# EAGLE design ESP32 AT UWB Pro with Display v1.1 (EAGLE 6.1)
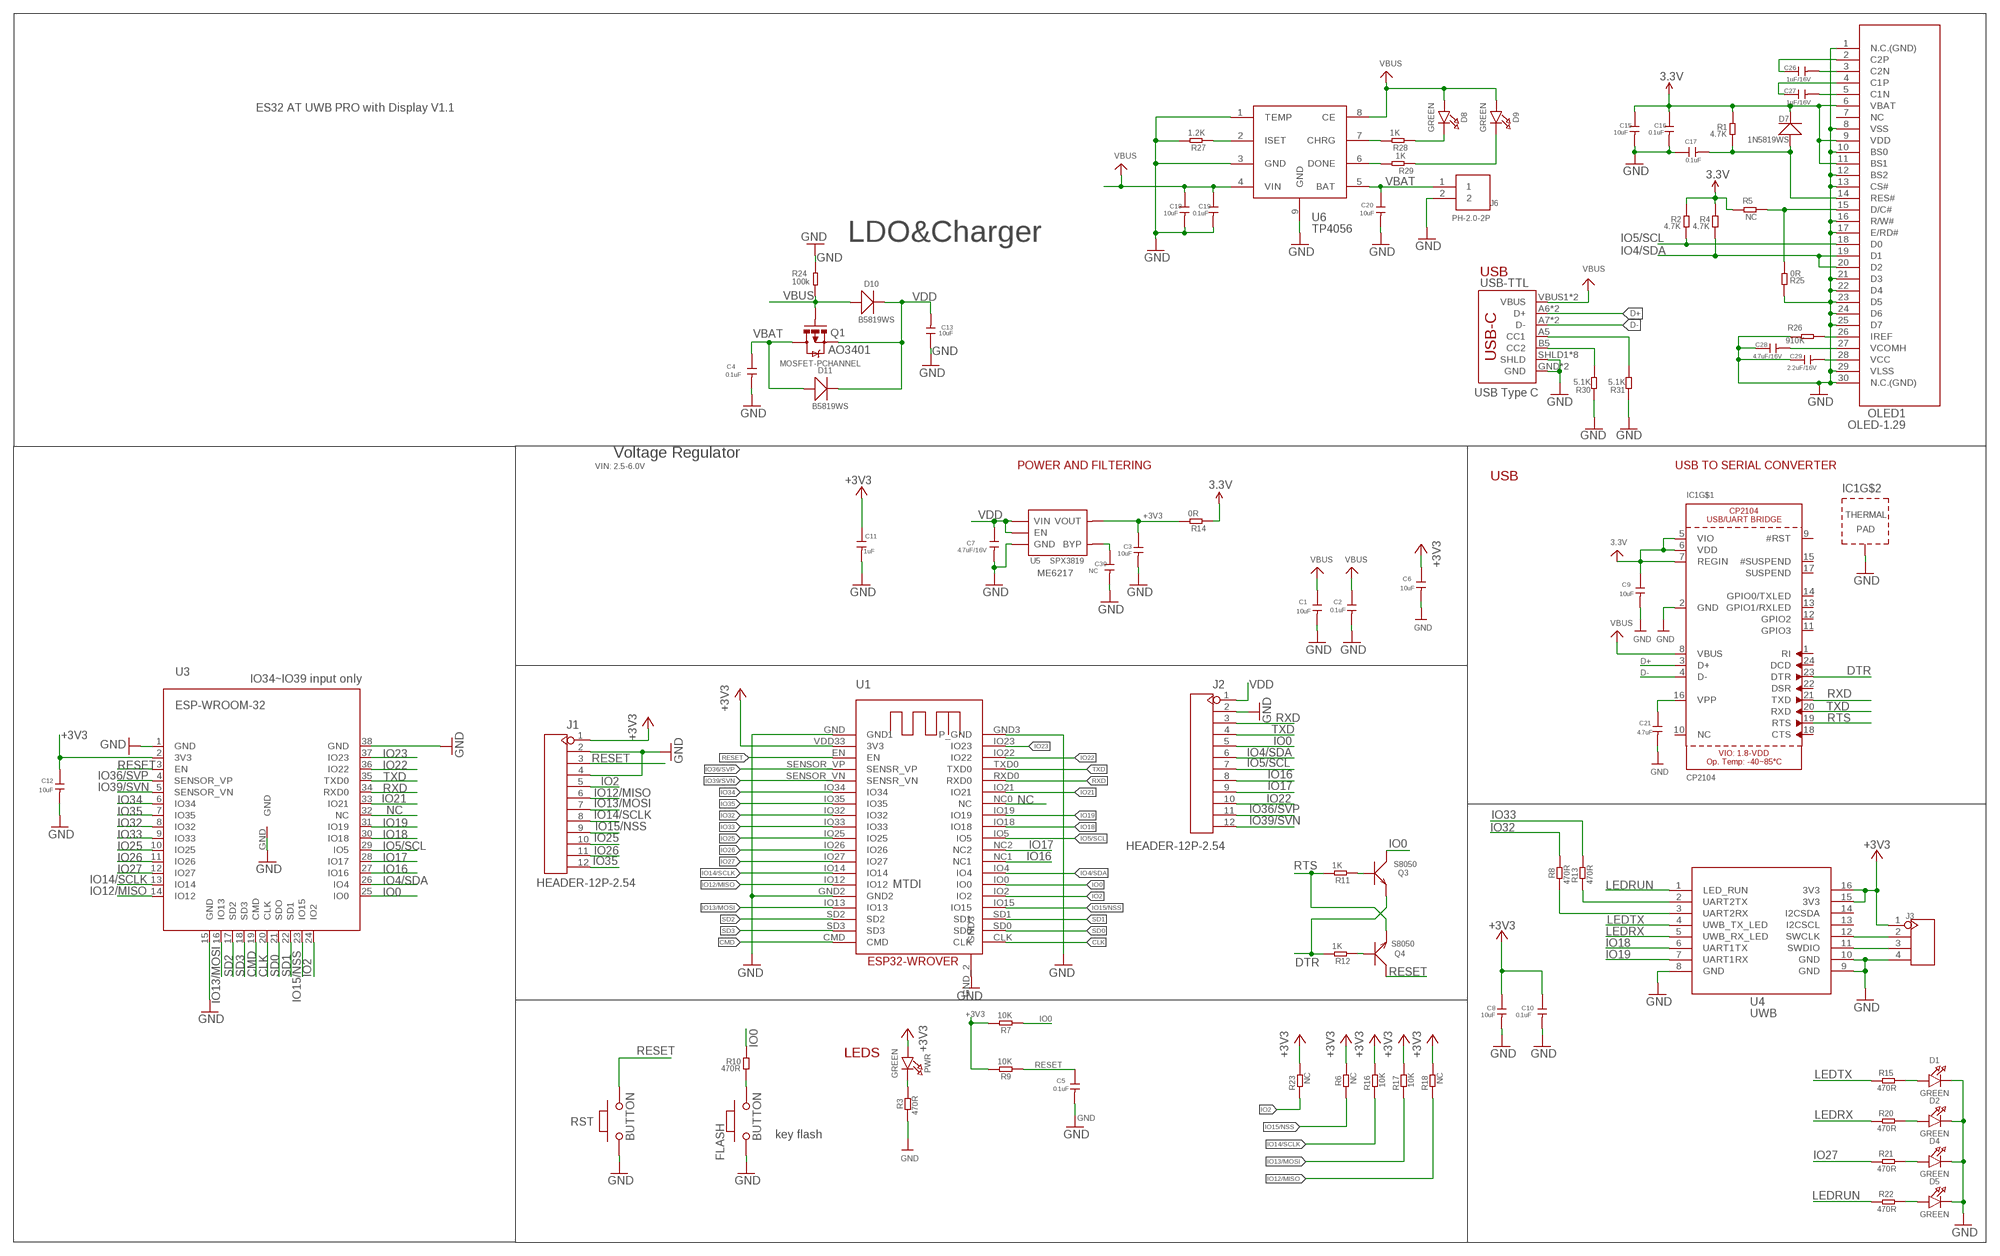
[diagram p0: schematic, sheet 1]

## Parts
C1  10uF  C-0603  [0603]
C2  0.1uF  C-0603  [0603]
C3  10uF  C-0603  [0603]
C4  0.1uF  C-0603  [0603]
C5  0.1uF  C-0603  [0603]
C6  10uF  C-0603  [0603]
C7  4.7uF/16V  C-0603  [0603]
C8  10uF  C-0603  [0603]
C9  10uF  C-0603  [0603]
C10  0.1uF  C-0603  [0603]
C11  1uF  C-0603  [0603]
C12  10uF  C-0603  [0603]
C13  10uF  C-0603  [0603]
C15  10uF  C-0603  [0603]
C16  0.1uF  C-0603  [0603]
C17  0.1uF  C-0603  [0603]
C18  10uF  C-0603  [0603]
C19  0.1uF  C-0603  [0603]
C20  10uF  C-0603  [0603]
C21  4.7uF  C-0603  [0603]
C26  1uF/16V  C-0603  [0603]
C27  1uF/16V  C-0603  [0603]
C28  4.7uF/16V  C-0603  [0603]
C29  2.2uF/16V  C-0603  [0603]
C30  NC  C-0603  [0603]
D1  GREEN  LED0805_NOOUTLINE  [CHIPLED_0805_NOOUTLINE]
D2  GREEN  LED0805_NOOUTLINE  [CHIPLED_0805_NOOUTLINE]
D4  GREEN  LED0805_NOOUTLINE  [CHIPLED_0805_NOOUTLINE]
D5  GREEN  LED0805_NOOUTLINE  [CHIPLED_0805_NOOUTLINE]
D7  1N5819WS  D'0805'  [SOD323]
D8  GREEN  LED0805_NOOUTLINE  [CHIPLED_0805_NOOUTLINE]
D9  GREEN  LED0805_NOOUTLINE  [CHIPLED_0805_NOOUTLINE]
D10  B5819WS  D'0805'  [SOD323]
D11  B5819WS  D'0805'  [SOD323]
FLASH  BUTTON  PB157  [157SW]
IC1  CP2104  [QFN24_4MM_SMSC]
J1  HEADER-12P-2.54  [12P-2.54]
J2  HEADER-12P-2.54  [12P-2.54]
J3  HEADER-4P-60/35MILROUND  [4P-65/35ROUND]
J6  PH-2.0-2P  [PH-2.0-2P]
OLED1  OLED-1.29  [OLED-1.29]
PWR  GREEN  LED0805_NOOUTLINE  [CHIPLED_0805_NOOUTLINE]
Q1  MOSFET-PCHANNEL  [SOT23-3]
Q3  S8050  TRANSISTOR-NPN-SOT23  [SOT23]
Q4  S8050  TRANSISTOR-NPN-SOT23  [SOT23]
R1  4.7K  R-0603  [R0603]
R2  4.7K  R-0603  [R0603]
R3  470R  R-0603  [R0603]
R4  4.7K  R-0603  [R0603]
R5  NC  R-0603  [R0603]
R6  NC  R-0603  [R0603]
R7  10K  R-0603  [R0603]
R8  470R  R-0603  [R0603]
R9  10K  R-0603  [R0603]
R10  470R  R-0603  [R0603]
R11  1K  R-0603  [R0603]
R12  1K  R-0603  [R0603]
R13  470R  R-0603  [R0603]
R14  0R  R-0603  [R0603]
R15  470R  R-0603  [R0603]
R16  10K  R-0603  [R0603]
R17  10K  R-0603  [R0603]
R18  NC  R-0603  [R0603]
R20  470R  R-0603  [R0603]
R21  470R  R-0603  [R0603]
R22  470R  R-0603  [R0603]
R23  NC  R-0603  [R0603]
R24  100k  R-0603  [R0603]
R25  0R  R-0603  [R0603]
R26  910K  R-0603  [R0603]
R27  1.2K  R-0603  [R0603]
R28  1K  R-0603  [R0603]
R29  1K  R-0603  [R0603]
R30  5.1K  DISCRETE_R-0603  [DISCRETE_R0603]
R31  5.1K  DISCRETE_R-0603  [DISCRETE_R0603]
RST  BUTTON  PB157  [157SW]
U1  ESP32-WROVER  [ESP32-WROVER]
U3  ESP-WROOM-32  [ESP-WROOM-32]
U4  UWB  [UWB]
U5  SPX3819  [SOT23-5]
U6  TP4056  [SOP8-1.27P]
USB-TTL  USB_C5  [USB-C-16P-5]

## Nets
3.3V: C15.1 C16.1 D7.- OLED1.6(VBAT) OLED1.9(VDD) OLED1.11(BS1) R1.2 R2.2 R4.2 R5.2 R14.1
+3V3: C3.1 C6.1 C8.1 C9.1 C10.1 C11.1 C12.1 IC1.5(VIO) IC1.6(VDD) IC1.7(REGIN) J1.1 J3.1 PWR.A R6.2 R7.2 R9.2 R14.2 R16.2 R17.2 R18.2 R23.2 U1.VDD33(3V3) U3.2(3V3) U4.15(3V3) U4.16(3V3) U5.5(VOUT) ; supply symbol labelled 3.3V
CLK: U1.CLK U3.20(CLK)
CMD: U1.CMD U3.19(CMD)
D+: IC1.3(D+) USB-TTL.A6(D+) USB-TTL.B6(D+)
D-: IC1.4(D-) USB-TTL.A7(D-) USB-TTL.B7(D-)
DTR: IC1.23(DTR) Q3.2(E) R12.2
GND: C1.2 C2.2 C3.2 C4.2 C5.2 C6.2 C7.2 C8.2 C9.2 C10.2 C11.2 C12.2 C13.1 C15.2 C16.2 C17.1 C18.2 C19.2 C20.2 C21.2 C28.1 C29.1 C30.2 D1.C D2.C D4.C D5.C FLASH.1 IC1.2(GND) IC1.THERM(TP) J1.2 J1.4 J2.2 J3.4 J6.2 OLED1.1(N.C.(GND)) OLED1.8(VSS) OLED1.10(BS0) OLED1.12(BS2) OLED1.13(CS#) OLED1.16(R/W#) OLED1.17(E/RD#) OLED1.21(D3) OLED1.22(D4) OLED1.23(D5) OLED1.24(D6) OLED1.25(D7) OLED1.29(VLSS) OLED1.30(N.C.(GND)) R3.1 R24.2 R25.2 R26.2 R27.2 R30.1 R31.1 RST.1 U1.GND2 U1.GND3(P_GND) U1.GND(GND1) U1.GND_2(GND3) U3.1(GND) U3.15(GND) U3.38(GND) U3.GND U4.8(GND) U4.9(GND) U4.10(GND) U5.2(GND) U6.1(TEMP) U6.3(GND) U6.9(GND) USB-TTL.GND USB-TTL.GND2(GND) USB-TTL.SHLD1(SHLD) USB-TTL.SHLD2(SHLD) USB-TTL.SHLD3(SHLD) USB-TTL.SHLD4(SHLD) USB-TTL.SHLD5(SHLD) USB-TTL.SHLD6(SHLD) USB-TTL.SHLD7(SHLD) USB-TTL.SHLD8(SHLD)
IO0: J2.5 Q3.3(C) R7.1 R10.2 U1.IO0 U3.25(IO0)
IO2: J1.5 R23.1 U1.IO2 U3.24(IO2)
IO4/SDA: J2.6 OLED1.19(D1) OLED1.20(D2) R4.1 U1.IO4 U3.26(IO4)
IO5/SCL: J2.7 OLED1.18(D0) R2.1 U1.IO5 U3.29(IO5)
IO12/MISO: J1.6 R18.1 U1.IO12 U3.14(IO12)
IO13/MOSI: J1.7 R17.1 U1.IO13 U3.16(IO13)
IO14/SCLK: J1.8 R16.1 U1.IO14 U3.13(IO14)
IO15/NSS: J1.9 R6.1 U1.IO15 U3.23(IO15)
IO16: J2.8 U1.NC1 U3.27(IO16)
IO17: J2.9 U1.NC2 U3.28(IO17)
IO18: U1.IO18 U3.30(IO18) U4.6(UART1TX)
IO19: U1.IO19 U3.31(IO19) U4.7(UART1RX)
IO21: U1.IO21 U3.33(IO21)
IO22: J2.10 U1.IO22 U3.36(IO22)
IO23: U1.IO23 U3.37(IO23)
IO25: J1.10 U1.IO25 U3.10(IO25)
IO26: J1.11 U1.IO26 U3.11(IO26)
IO27: R21.1 U1.IO27 U3.12(IO27)
IO32: R8.2 U1.IO32 U3.8(IO32)
IO33: R13.2 U1.IO33 U3.9(IO33)
IO34: U1.IO34 U3.6(IO34)
IO35: J1.12 U1.IO35 U3.7(IO35)
IO36/SVP: J2.11 U1.SENSOR_VP(SENSR_VP) U3.4(SENSOR_VP)
IO39/SVN: J2.12 U1.SENSOR_VN(SENSR_VN) U3.5(SENSOR_VN)
LEDRUN: R22.1 U4.1(LED_RUN)
LEDRX: R20.1 U4.5(UWB_RX_LED)
LEDTX: R15.1 U4.4(UWB_TX_LED)
N$1: D1.A R15.2
N$2: C21.1 IC1.16(VPP)
N$3: C17.2 D7.+ OLED1.14(RES#) R1.1
N$4: OLED1.15(D/C#) R5.1 R25.1
N$5: PWR.C R3.2
N$6: C28.2 OLED1.27(VCOMH)
N$7: C26.2 OLED1.3(C2N)
N$8: C29.2 OLED1.28(VCC)
N$9: OLED1.26(IREF) R26.1
N$10: R13.1 U4.2(UART2TX)
N$11: R8.1 U4.3(UART2RX)
N$13: Q4.1(B) R12.1
N$14: Q3.1(B) R11.1
N$15: FLASH.2 R10.1
N$16: D2.A R20.2
N$17: D4.A R21.2
N$18: D5.A R22.2
N$19: C26.1 OLED1.2(C2P)
N$21: C27.1 OLED1.4(C1P)
N$22: C27.2 OLED1.5(C1N)
N$23: R27.1 U6.2(ISET)
N$25: R31.2 USB-TTL.A5(CC1)
N$26: R30.2 USB-TTL.B5(CC2)
N$27: J3.3 U4.11(SWDIO)
N$28: J3.2 U4.12(SWCLK)
N$29: R28.2 U6.7(CHRG)
N$30: R29.2 U6.6(DONE)
N$31: D8.C R28.1
N$32: D9.C R29.1
N$76: C30.1 U5.4(BYP)
NC: U1.NC0(NC) U3.32(NC)
RESET: C5.1 J1.3 Q4.3(C) R9.1 RST.2 U1.EN U3.3(EN)
RTS: IC1.19(RTS) Q4.2(E) R11.2
RXD: IC1.21(TXD) J2.3 U1.RXD0 U3.34(RXD0)
SD0: U1.SD0 U3.21(SDO)
SD1: U1.SD1 U3.22(SD1)
SD2: U1.SD2 U3.17(SD2)
SD3: U1.SD3 U3.18(SD3)
TXD: IC1.20(RXD) J2.4 U1.TXD0 U3.35(TXD0)
VBAT: C4.1 C20.1 D11.+ J6.1 Q1.3(D) U6.5(BAT)
VBUS: C1.1 C2.1 C18.1 C19.1 D8.A D9.A D10.+ IC1.8(VBUS) Q1.1(G) R24.1 U6.4(VIN) U6.8(CE) USB-TTL.VBUS1(VBUS) USB-TTL.VBUS2(VBUS)
VDD: C7.1 C13.2 D10.- D11.- J2.1 Q1.2(S) U5.1(VIN) U5.3(EN)
Unconnected: IC1.1(RI) IC1.9(#RST) IC1.10(NC) IC1.11(GPIO3) IC1.12(GPIO2) IC1.13(GPIO1/RXLED) IC1.14(GPIO0/TXLED) IC1.15(#SUSPEND) IC1.17(SUSPEND) IC1.18(CTS) IC1.22(DSR) IC1.24(DCD) OLED1.7(NC) U4.13(I2CSCL) U4.14(I2CSDA)

## Notes on the sheet
- ES32 AT UWB PRO with Display V1.1
- LDO&Charger
- USB
- AO3401
- USB Type C
- Voltage Regulator
- VIN: 2.5-6.0V | POWER AND FILTERING | USB TO SERIAL CONVERTER
- USB
- ME6217
- IO34~IO39 input only
- MTDI
- LEDS
- key flash

## Library data of the parts
C1-C13 C15-C21 C26-C30 = Discrete:C*: Ceramic Capacitors
D1 D2 D4 D5 D8 D9 PWR = microbuilder:LED: LED 0603 - 0603 Surface Mount Package 2mA: Green LED - Low Power (3.9mcd, 2ma, 1.7Vf) - Digikey: 475-2709-2-ND Orange LED - Low Power (9.8mcd, 2ma, 1.8Vf) - Digikey: 475-1194-2-ND Red LED - Low Power (5mcd, 2ma, 1.8Vf) - Digikey: 475-1195-2-ND Yellow LED - Low Power (7mcd, 2ma, 1.8Vf) - Digikey: 475-1196-2-ND 5mA: Blue LED - Low Power (17mcd, 5ma, 2.9Vf) - Digikey: LNJ937W8CRACT-ND 0805 - 0805 Surface Mount Package 2mA: Red LED (8.8mcd, 2mA, 1.8Vf, Clear) - Low Power [Digikey: 475-2510-1-ND] Green LED (5mcd, 2mA, 1.8Vf, Clear) - Low Power [Digikey: 475-2730-1-ND] Yellow LED (11.3mcd, 2mA, 1.8Vf, Clear) - Low Power [Digikey: 475-2555-1-ND] 20mA: Red LED (104mcd, 20mA, Diffused) - LS R976 [Digikey: 475-1278-6-ND] Red LED (12mcd, 20mA, 2.0Vf, Clear) - APT2012EC [Digikey: 754-1128-1-ND] Green LED (15mcd, 20mA, 2.2Vf, Clear) - APT2012GC [Digikey: 754-1131-1-ND] Orange LED (160mcd, 20mA, 2.1Vf, Clear) - APT2012SECK [Digikey: 754-1130-1-ND] 1206 - 1206 Surface Mount Package Green LED (26mcd, 20mA, Diffused) - LG N971 [Digikey: 475-1407-6-ND] Red LED (15mcd, 20mA, Diffused) - LH N974 [Digikey: 475-1416-6-ND] Cree - Cree High-Power Surface Mount LEDs XPEBWT-L1-0000-00D50 - White 111lm 350mA 2.9Vf 6200K 110° XTEAWT-00-0000-00000LEE3 - White 114lm 350mA 2.85Vf 5000K 115° Everlight - Everlight 45-21 Series Surface Mount LEDs 45-21/QK2C-B2832AC2CB2/2T - Warm White 2000mcd 20mA 3.25Vf 3050K 120° 45-21/LK2C-B38452C4CB2/2T - Nuetral White 2000mcd 20mA 3.25Vf 4150K 120° 45-21/LK2C-B50634C6CB2/2T - Cold White 2200mcd 20mA 3.25Vf 5650K 120° PLCC2 Reverse Mount LS T77K-J1L2-1-0-2-R18-Z - Red 11.25mcd 2mA 1.8Vf 630nm 120° LO T77K-L1M2-24-Z - Orange 19.6mcd 2mA 1.8Vf 606nm 120° LY T77K-K2M1-26-Z - Yellow 15.7mcd 2mA 1.8Vf 587nm 120°
D7 D10 D11 = Discrete:D*
FLASH RST = MySMD:PB157
IC1 = microbuilder:CP2104: CP2104 - USB to UART Bridge VDD Output: 3.45V
J1 J2 = Connector:HEADER-12P
J3 = Connector:HEADER-4P
J6 = Connector:PH-2.0-2P
OLED1 = sale:OLED-1.29
Q1 = User-Submitted:MOSFET-PCHANNEL: Generic PMOSFET IRLML2244 - TRANS-11153 (SOT-23 -20V -4.3A) (1.Gate 2.Source 3.Drain) FQP27P06 - COM-10349 <http://www.sparkfun.com/products/10349> (TO-220 -60V -27A) (1.Gate 2.Source 3.Drain); PROD_ID: TRANS-08285
Q3 Q4 = Discrete:TRANSISTOR-NPN*: NPN audion
R1-R18 R20-R29 = Discrete:R*
R30 R31 = A9G:DISCRETE_R*
U1 = ESP32-Wrover:ESP32-WROVER
U3 = esp32:ESP-WROOM-32
U4 = sale:UWB
U5 = IC:SPX3819
U6 = self:TP4056
USB-TTL = USBC:USB_C: USB Type C 16Pin Connector Super Speed pins not available on the 16-pin purely SMD connector so this part is best for USB 2.0 implementations. D1 and D2 are tied together enabling D+/- no matter which way the cable is plugged into the connector. The two channel configuration pins (CC1/2) are exposed. These are normally connected to ground via 5.1k resistors but can be reconfigured for high current/high power applications.

## Net classes
0 default: width 0.152 mm, drill 0.305 mm, clearance 0.152 mm

## Board
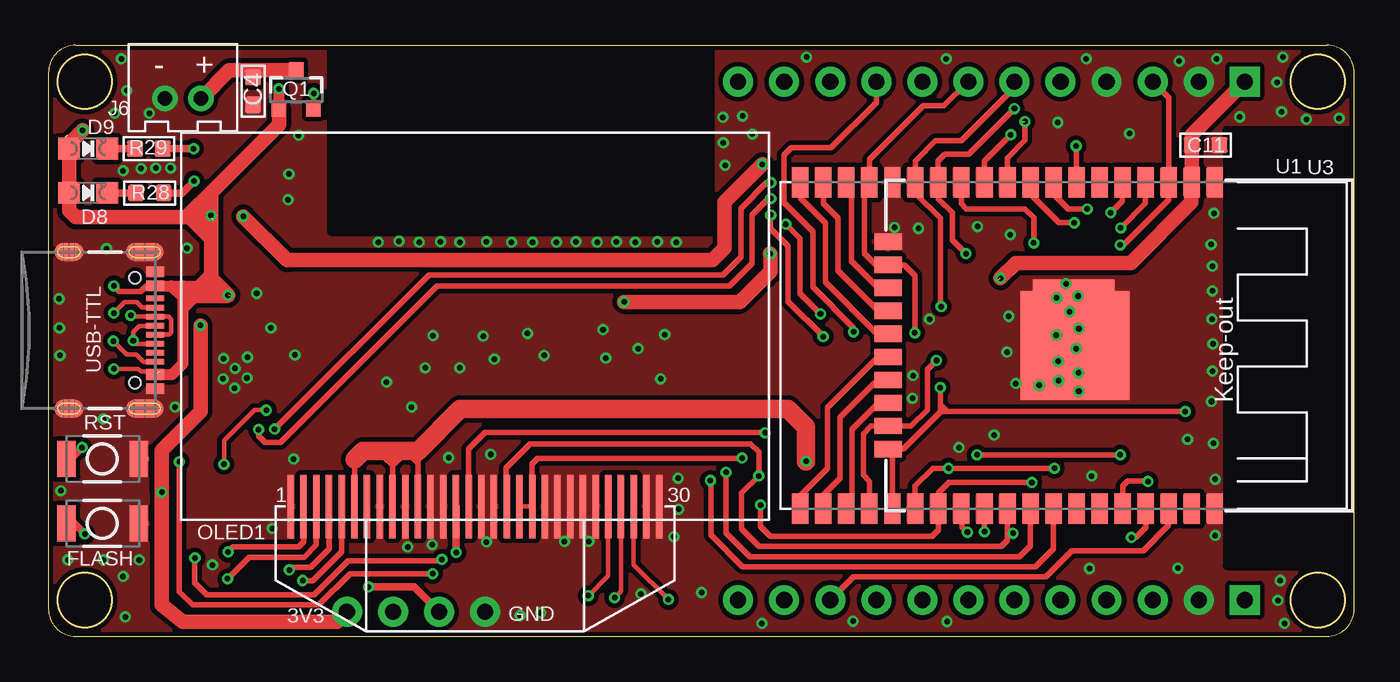
[diagram p1: board, top side]
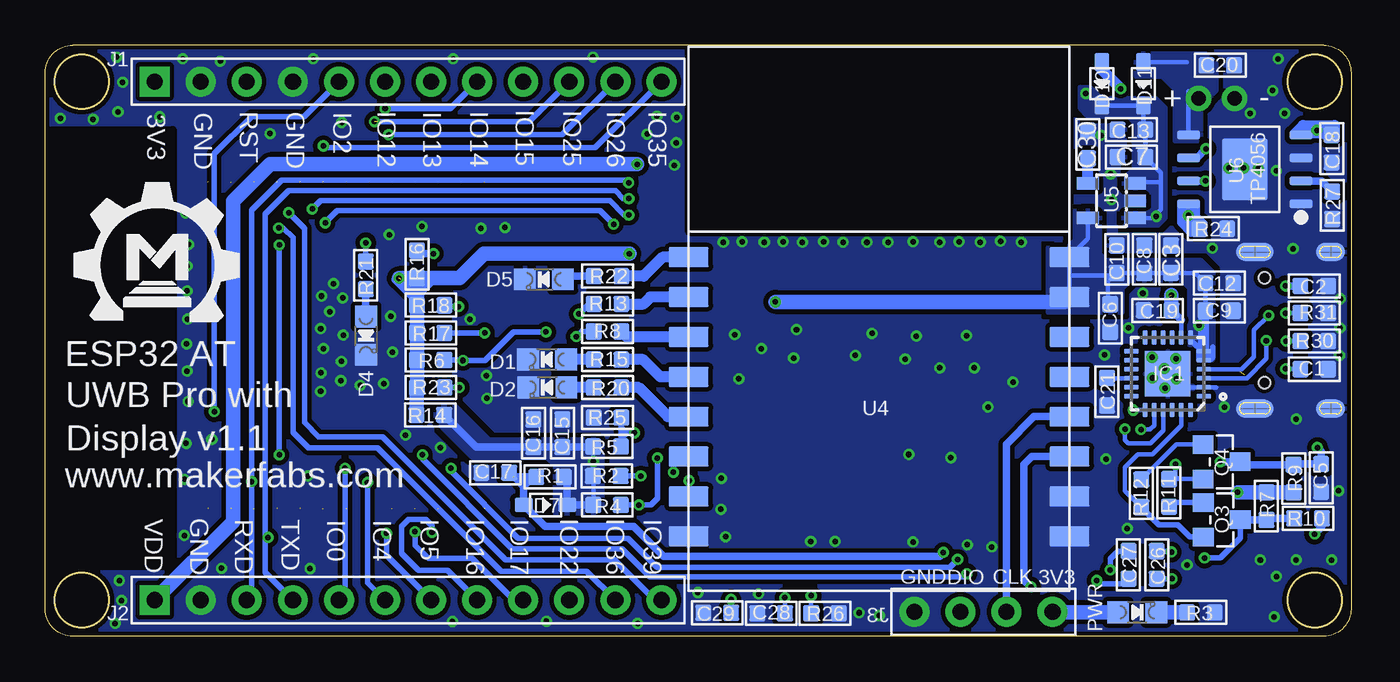
[diagram p2: board, bottom side, seen from below]

Size 72 x 32.6 mm. Coordinates in mm from the lower left corner, seen from the top.
Outline: 70.5,0 arc90 72,1.5 72,31.1 arc90 70.5,32.6 1.5,32.6 arc90 0,31.1 0,1.5 arc90 1.5,0 70.5,0
Outline: circle at 2,2 radius 1.5
Outline: circle at 2,30.6 radius 1.5
Outline: circle at 70,30.6 radius 1.5
Outline: circle at 70,2 radius 1.5
Copper layers (1*16): Top 0.035mm / dielectric 1.5mm / Bottom 0.035mm
Design rules: minimum track width 10mil, minimum drill 10mil, track to track 8mil, track to pad 8mil, pad to pad 8mil, via to via 8mil, smd to smd 0mil, copper to edge 10mil, drill to drill 8mil, minimum pad ring 10mil, minimum via ring 6mil, stop-mask expansion 4mil, vias tented up to drill 100mil, thermal gap 0mil
tRestrict: area 65,3.9 to 72,27.9; area 15.6,22.3 to 36.5,34.4
bRestrict: area 65,3.9 to 72,27.9; area 15.6,22.3 to 36.5,34.4

### Footprints (pad centres in the part's own frame; a part is rotated, then mirrored left to right if it is on the bottom)
0603 = smd 0.889 x 0.889: 1 -0.762,0; 2 0.762,0
CHIPLED_0805_NOOUTLINE = smd 1.2 x 1.2: A 0,-1.05; C 0,1.05
SOD323 = smd 1 x 0.8: + -1.2,0; - 1.2,0
157SW = smd 1.016 x 1.981: 1 0,0; 2 4,0
QFN24_4MM_SMSC = smd 0.8 x 0.28: 1 -2,1.25; 2 -2,0.75; 3 -2,0.25; 4 -2,-0.25; 5 -2,-0.75; 6 -2,-1.25; 13 2,-1.25; 14 2,-0.75; 15 2,-0.25; 16 2,0.25; 17 2,0.75; 18 2,1.25 | smd 0.28 x 0.8: 7 -1.25,-2; 8 -0.75,-2; 9 -0.25,-2; 10 0.25,-2; 11 0.75,-2; 12 1.25,-2; 19 1.25,2; 20 0.75,2; 21 0.25,2; 22 -0.25,2; 23 -0.75,2; 24 -1.25,2 | smd 2.5 x 2.5: THERM 0,0
12P-2.54 = drill 0.889 pad 1.651 square: 1 0,13.97 | drill 0.889 pad 1.651: 2 0,11.43; 3 0,8.89; 4 0,6.35; 5 0,3.81; 6 0,1.27; 7 0,-1.27; 8 0,-3.81; 9 0,-6.35; 10 0,-8.89; 11 0,-11.43; 12 0,-13.97
4P-65/35ROUND = drill 0.889 pad 1.651: 1 0,3.81; 2 0,1.27; 3 0,-1.27; 4 0,-3.81
PH-2.0-2P = drill 0.8 pad 1.4: 1 -1,0; 2 1,0
OLED-1.29 = smd 0.4 x 3.5: 1 -10.15,-9.94; 2 -9.45,-9.94; 3 -8.75,-9.94; 4 -8.05,-9.94; 5 -7.35,-9.94; 6 -6.65,-9.94; 7 -5.95,-9.94; 8 -5.25,-9.94; 9 -4.55,-9.94; 10 -3.85,-9.94; 11 -3.15,-9.94; 12 -2.45,-9.94; 13 -1.75,-9.94; 14 -1.05,-9.94; 15 -0.35,-9.94; 16 0.35,-9.94; 17 1.05,-9.94; 18 1.75,-9.94; 19 2.45,-9.94; 20 3.15,-9.94; 21 3.85,-9.94; 22 4.55,-9.94; 23 5.25,-9.94; 24 5.95,-9.94; 25 6.65,-9.94; 26 7.35,-9.94; 27 8.05,-9.94; 28 8.75,-9.94; 29 9.45,-9.94; 30 10.15,-9.94
SOT23-3 = smd 0.8 x 0.9: 1 -0.95,-1; 2 0.95,-1; 3 0,1.1
SOT23 = smd 1.016 x 1.143: 1 -0.95,-1.016; 2 0.95,-1.016; 3 0,1.016
R0603 = smd 0.889 x 0.889: 1 -0.762,0; 2 0.762,0
DISCRETE_R0603 = smd 0.889 x 0.889: 1 -0.762,0; 2 0.762,0
ESP32-WROVER = smd 1.7 x 0.9: CLK 18,1.27; CMD 0,1.27; EN 0,21.59; GND 0,24.13; GND3 18,24.13; GND_2 0,6.35; IO0 18,7.62; IO2 18,6.35; IO4 18,8.89; IO5 18,12.7; IO12 0,7.62; IO13 0,5.08; IO14 0,8.89; IO15 18,5.08; IO18 18,13.97; IO19 18,15.24; IO21 18,17.78; IO22 18,21.59; IO23 18,22.86; IO25 0,12.7; IO26 0,11.43; IO27 0,10.16; IO32 0,15.24; IO33 0,13.97; IO34 0,17.78; IO35 0,16.51; NC0 18,16.51; NC1 18,10.16; NC2 18,11.43; RXD0 18,19.05; SD0 18,2.54; SD1 18,3.81; SD2 0,3.81; SD3 0,2.54; SENSOR_VN 0,19.05; SENSOR_VP 0,20.32; TXD0 18,20.32; VDD33 0,22.86 | smd 4.5 x 4.5: GND2 7.62,16.34
ESP-WROOM-32 = smd 0.9 x 1.5: 1 7.7,9; 2 6.43,9; 3 5.16,9; 4 3.89,9; 5 2.62,9; 6 1.35,9; 7 0.08,9; 8 -1.19,9; 9 -2.46,9; 10 -3.73,9; 11 -5,9; 12 -6.27,9; 13 -7.54,9; 14 -8.81,9; 25 -8.81,-9; 26 -7.54,-9; 27 -6.27,-9; 28 -5,-9; 29 -3.73,-9; 30 -2.46,-9; 31 -1.19,-9; 32 0.08,-9; 33 1.35,-9; 34 2.62,-9; 35 3.89,-9; 36 5.16,-9; 37 6.43,-9; 38 7.7,-9 | smd 1.5 x 0.9: 15 -10.3,5.715; 16 -10.3,4.445; 17 -10.3,3.175; 18 -10.3,1.905; 19 -10.3,0.635; 20 -10.3,-0.635; 21 -10.3,-1.905; 22 -10.3,-3.175; 23 -10.3,-4.445; 24 -10.3,-5.715 | smd 6 x 6: GND 0,0
UWB = smd 2.2 x 1.1: 1 0,18.4; 2 0,16.2; 3 0,14; 4 0,11.8; 5 0,9.6; 6 0,7.4; 7 0,5.2; 8 0,3; 9 21,3; 10 21,5.2; 11 21,7.4; 12 21,9.6; 13 21,11.8; 14 21,14; 15 21,16.2; 16 21,18.4
SOT23-5 = smd 0.69 x 1.2: 1 -0.95,-1.3; 2 0,-1.3; 3 0.95,-1.3; 4 0.95,1.3; 5 -0.95,1.3
SOP8-1.27P = smd 1.27 x 0.51: 1 -3.1,1.905; 2 -3.1,0.635; 3 -3.1,-0.635; 4 -3.1,-1.905; 5 3.1,-1.905; 6 3.1,-0.635; 7 3.1,0.635; 8 3.1,1.905 | smd 2.5 x 3.4: 9 0,0
USB-C-16P-5 = smd 0.3 x 1: A5 -1.25,-0.34; A6 -0.25,-0.34; A7 0.25,-0.34; A8 1.25,-0.34; B5 1.75,-0.34; B6 0.75,-0.34; B7 -0.75,-0.34; B8 -1.75,-0.34 | smd 0.6 x 1: GND -3.225,-0.34; GND2 3.225,-0.34; VBUS1 -2.45,-0.34; VBUS2 2.45,-0.34 | smd 1 x 2.1: SHLD1 -4.32,-0.915; SHLD2 4.32,-0.915 | smd 1 x 2.1 bottom: SHLD3 -4.32,-0.915; SHLD4 4.32,-0.915 | smd 1 x 1.6: SHLD5 -4.32,-5.095; SHLD8 4.32,-5.095 | smd 1 x 1.6 bottom: SHLD6 -4.32,-5.095; SHLD7 4.32,-5.095 | hole 0.65: -2.89,-1.445; 2.89,-1.445

### Placement (x,y rotation side)
C1  2.03,14.73 0 bottom
C2  2.03,19.33 0 bottom
C3  9.93,20.8 90 bottom
C4  11.28,30.07 270 top
C5  1.65,8.74 270 bottom
C6  13.28,17.55 270 bottom
C7  12.12,26.44 180 bottom
C8  11.4,20.79 90 bottom
C9  7.26,17.96 0 bottom
C10  12.92,20.8 90 bottom
C11  63.8,27.1 0 top
C12  7.26,19.48 0 bottom
C13  12.12,27.94 0 bottom
C15  43.48,11.2 90 bottom
C16  45.09,11.2 90 bottom
C17  47.19,9.02 0 bottom
C18  1.07,26.9 270 bottom
C19  10.67,17.98 180 bottom
C20  7.21,31.5 0 bottom
C21  13.46,13.49 270 bottom
C26  10.72,3.94 270 bottom
C27  12.27,3.94 270 bottom
C28  31.98,1.27 0 bottom
C29  34.95,1.3 0 bottom
C30  14.5,27.13 90 bottom
D1  44.34,15.27 90 bottom
D2  44.32,13.73 90 bottom
D4  54.32,16.58 180 bottom
D5  44.51,19.69 90 bottom
D7  44.42,7.24 0 bottom
D8  2.18,24.46 270 top
D9  2.18,26.9 270 top
D10  13.74,30.48 270 bottom
D11  11.46,30.48 270 bottom
FLASH  5,6.22 180 top
IC1  10.11,14.48 180 bottom
J1  52,30.6 90 bottom
J2  52,2 90 bottom
J3  20.27,1.35 270 bottom
J6  7.42,29.67 180 top
OLED1  23.52,17.09 0 top
PWR  11.79,1.33 270 bottom
Q1  13.67,30.12 0 top
Q3  7.13,6.42 270 bottom
Q4  7.14,9.63 270 bottom
R1  44.17,8.79 0 bottom
R2  41.05,8.84 180 bottom
R3  8.28,1.32 180 bottom
R4  41.02,7.24 180 bottom
R5  41.02,10.46 180 bottom
R6  50.75,15.24 180 bottom
R7  4.67,7.18 90 bottom
R8  41,16.81 180 bottom
R9  3.17,8.7 270 bottom
R10  2.37,6.51 180 bottom
R11  10.04,7.91 90 bottom
R12  11.57,7.89 270 bottom
R13  41,18.34 180 bottom
R14  50.77,12.22 180 bottom
R15  41,15.27 180 bottom
R16  51.51,20.52 270 bottom
R17  50.75,16.74 180 bottom
R18  50.75,18.26 180 bottom
R20  41,13.72 180 bottom
R21  54.33,19.91 270 bottom
R22  41,19.86 180 bottom
R23  50.75,13.72 180 bottom
R24  7.59,22.48 0 bottom
R25  41,12.06 180 bottom
R26  29.01,1.27 0 bottom
R27  1.04,23.77 270 bottom
R28  5.59,24.46 0 top
R29  5.54,26.9 0 top
R30  2.03,16.28 180 bottom
R31  2.03,17.83 180 bottom
RST  5,9.78 180 top
U1  40.19,25.04 270 top
U3  56.6,16.05 0 top
U4  36.53,2.51 0 bottom
U5  13.21,24.03 90 bottom
U6  5.87,25.76 180 bottom
U$1  [MAKERFABS_0.3]  69.94,17.41 0 bottom
USB-TTL  6.22,16.88 270 top

### Tracks (layer width: path | path; a pad name or v marks a point on that pad's centre or on a via)
3.3V  (via drill 0.3)
  Top 0.305: OLED1.11 20.37,10.01 | 20.37,10.11 20.37,10.21 | OLED1.6 16.87,9.76 | 20.24,10.24 20.37,10.11 | OLED1.9 18.97,10.16 19.05,10.24 | 18.52,9.96 18.52,9.88 18.97,9.42 19.58,10.03 19.86,10.03 20.37,9.53 20.37,9.7 20.52,9.86 | 20.52,9.86 20.8,10.13 | 20.37,10.11 20.37,10.01 | 20.37,10.01 20.52,9.86
  Top 1.016: 20.37,10.21 22.71,12.55 40.79,12.55 41.78,11.56 v41.78,9.65 | 16.87,9.76 17.35,10.24 19.05,10.24 20.24,10.24
  Bottom 0.254: R4.2 41.78,8.81 R2.2 41.81,10.44 R5.2
  Bottom 0.406: R4.2 D7.- 43.23,8.6 R1.2 | 41.81,10.44 C15.1 C16.1 48.23,10.44 R14.1
  pour Bottom: 41.3,6.81 41.3,10.82 47.55,10.82 49.4,12.67 50.44,12.67 50.44,11.91 48.41,9.88 44.32,9.88 43.87,9.42 43.87,6.83 43.87,6.81
+3V3  (via drill 0.3)  (2 unrouted)
  Top 0.813: v52.5,19.76 53.34,20.6 59.69,20.6 63.03,23.94 U3.2 | U1.VDD33 C11.1 63.04,27.67 J1.1 | v31.75,18.44 38.12,18.44 39.8,20.12 v39.8,21.1 | J3.1 15.93,0.81 7.39,0.81 6.25,1.73 v6.25,7.95 6.25,10.26 8.39,12.4 v8.39,17.14
  Bottom 0.254: IC1.5 IC1.6 | 8.11,17.87 8.11,16.59 8.21,16.48 IC1.7 | C9.1 C12.1 8.59,20.04 C3.1 9.94,20.03 C8.1 C10.1 13.05,19.91 13.41,19.91 | U4.15 15.53,19.91 | 15.53,19.91 U4.16 14.51,21.93 U5.5 | 13.41,19.91 15.53,19.91 | C6.1 13.41,18.44 13.41,19.91
  Bottom 0.305: 7.62,15.95 7.62,15.42 7.8,15.24 8.41,15.24 8.41,15.93 8.71,16.23 8.71,16.2 8.2,15.7 8.2,15.32 8.08,15.32 7.82,15.57
  Bottom 0.406: 50.67,19.79 50.67,19.61 51.69,18.59 51.69,18.67 52.7,19.68 52.38,19.68 51.74,19.05
  Bottom 0.61: IC1.6 8.11,17.87 C9.1
  Bottom 0.813: R16.2 49.15,19.76 47.81,21.1 v39.8,21.1 | R16.2 R18.2 R17.2 R6.2 R23.2 51.54,13.69 R14.2 | R16.2 v52.5,19.76 | v31.75,18.44 15.8,18.44 U4.15 | PWR.A 16.44,1.33 J3.1 | R9.2 R7.2 v6.25,7.95
  pour Bottom: 7.67,15.21 8.43,15.21 8.43,15.9 8.61,16.08 8.92,16.08 8.92,19.2 9.35,19.63 12.17,19.63 12.62,19.18 12.62,17.88 12.6,17.86 16.71,17.86 16.71,21.44 15.65,21.44 15.24,21.84 15.24,23.5 13.84,23.5 13.84,21.08 13.56,20.8 13.51,20.75 12.6,20.75 8.28,20.75 7.59,20.07 7.59,15.29
CLK
  Top 0.305: U1.CLK 41.46,7.78 42.95,9.27 42.95,12.62 45.72,15.39 46.28,15.39 U3.20
CMD
  Top 0.305: U1.CMD 41.46,24.18 42.85,22.78 42.85,19.53 45.7,16.69 U3.19
D+  (via drill 0.3)
  Top 0.254: USB-TTL.A6 5.87,17.12 5,17.12 4.67,16.79 v4.67,16.31 4.85,16.13 USB-TTL.B6
  Bottom 0.254: IC1.3 5.76,14.23 4.67,15.32 v4.67,16.31
D-  (via drill 0.3)
  Top 0.254: USB-TTL.A7 6.65,16.63 6.78,16.76 6.78,17.48 6.62,17.63 USB-TTL.B7 4.62,17.63 v4.55,17.7
  Bottom 0.254: IC1.4 6.05,14.73 5.36,15.42 5.36,16.89 v4.55,17.7
DTR
  Bottom 0.254: R12.2 12.47,8.03 12.47,9.32 11.76,10.03 10.95,10.03 9.36,11.62 IC1.23
  Bottom 0.305: Q3.2 8.88,5.47 9.55,6.15 10.59,6.15 R12.2
GND  (via drill 0.3)
  Bottom 0.254: IC1.2 9.16,13.73 v9.63,14.2 | 8.08,13.72 7.42,13.72
  other vias: 39.34,0.71 34.49,5.49 36.02,2.41 30.73,15.34 22.07,9.86 64.19,19.05 50.22,10.41 47.65,13.13 55.6,18.67 56.79,14.53 56.67,15.88 55.7,14.1 56.11,19.46 56.31,17.91 56.82,16.97 55.58,16.61 55.68,15.16 56.82,13.51 53.34,13.94 52.86,15.67 52.96,17.65 56.77,18.77 54.64,13.84 64.11,21.62 64.19,20.42 27.33,15.49 64.21,16.13 64.19,14.63 4.32,30.1 64.24,10.64 32.51,15.88 64.34,5.56 1.07,4.22 68.15,0.71 67.92,3.07 4.24,1.07 44.37,0.84 62.81,10.87 64.14,12.95 48.59,17.5 53.04,22.15 51.23,22.61 55.65,28.35 59.61,27.74 68.07,31.95 67.74,30.56 68,28.93 71.17,28.57 24.59,15.29 65.68,28.65 62.36,31.72 64.41,31.85 38.81,27.71 38.28,28.7 69.37,28.52 64.26,23.34 32.66,2.34 64.16,17.5 3.66,28.85 20.78,14.81 47.98,22.5 27.13,1.3 24.38,10.03 49.56,0.81 62.28,3.76 67.79,1.98 4.11,3.3 26.01,1.14 64.34,8.66 4.01,31.85 47.68,14.38 52.15,11.1 57.53,8.84 57.4,3.73 9.65,15.32 10.97,15.39 10.29,14.78 10.95,14.25 10.26,13.69 6.99,12.65 3.02,11.99 3.2,21.39 13.21,24.08 13.79,27.64 18.19,21.74 20.45,21.74 22.68,21.74 25.53,21.74 28.02,21.74 30.25,21.74 32.36,21.74 34.62,21.74 26.42,16.71 30.58,16.92 33.76,14.2 33.99,16.64 20.02,12.65 18.64,14.02 13.59,15.52 12.27,17.02 11.48,18.92 13.51,9.78 12.34,5.94 41.81,31.95 49.5,31.85 57.23,31.85 37.21,27.23 19.81,4.93 21.16,5.05 24.16,5.21 28.45,5.23 29.79,5.23 5.11,25.81 5.92,25.83 6.73,25.83 4.11,25.68 5.56,28.85 7.65,21.41 0.58,18.62 0.61,17.02 0.64,15.49 0.69,8.03 3.02,4.22 5,4.22 9.04,3.94 34.75,7.01 34.72,8.71 13.26,25.5 46.66,22.56 21.21,16.59 23.98,16.56 22.68,14.81 19.33,21.79 21.62,21.77 24.16,21.77 26.7,21.74 29.08,21.77 31.32,21.77 33.58,21.77 37.19,28.63 37.31,25.98
  pour Top (isolate 0.254, rank 6): -8.51,37.36 75.44,37.36 75.44,-10 -8.52,-10 -8.52,37.36
  pour Bottom (isolate 0.254, rank 6): -2.29,36.12 76.2,35.56 76.2,-10 -2.29,-10
IO0  (via drill 0.3)  (1 unrouted)
  Top 0.305: v21.69,4.24 21.61,4.17 16.54,4.17 14.66,2.29 8.74,2.29 8.08,2.95 v8.08,4.32 | U3.25 47.79,8.29 48.77,9.27 v49.63,9.27 v55.47,9.27
  Bottom 0.305: v55.47,9.27 55.47,2.34 J2.5 | v21.69,4.24 22.12,3.81 38.28,3.81 39.88,5.41 45.92,5.41 49.63,9.12 v49.63,9.27 | Q3.3 6.11,5.42 7.21,4.32 v8.08,4.32
  Bottom 0.406: R10.2 4.58,6.51 R7.1 Q3.3
IO2  (via drill 0.3)
  Top 0.305: U1.IO2 46.54,10.1 U3.24 47.14,10.33 49.17,12.37 | 49.17,12.37 49.2,12.39 49.53,12.39 | v62.69,12.39 49.53,12.39 | v49.17,13.72 49.17,12.83 49.17,12.75 | 49.17,12.75 49.17,12.37 | 49.17,12.75 49.53,12.39
  Bottom 0.305: v62.69,12.39 62.69,26.62 60.63,28.68 57.73,28.68 J1.5 | v49.17,13.72 R23.1
IO4/SDA  (via drill 0.3)
  Top 0.254: OLED1.19 OLED1.20 | U3.26 U1.IO4
  Top 0.305: OLED1.20 26.67,9.5 26.98,9.8 38.23,9.8 v38.25,9.83 | U1.IO4 49.08,5.87 48.72,5.51 39.83,5.51 39.27,6.07 v39.27,7.24 | U1.IO4 49.07,7.9 49.66,8.48 v54.23,8.48
  Bottom 0.305: R4.1 v39.27,7.24 38.61,7.24 38.25,7.59 v38.25,9.83 | J2.6 54.23,2.96 v54.23,8.48
IO5/SCL  (via drill 0.3)  (1 unrouted)
  Top 0.254: 25.25,7.18 OLED1.18
  Top 0.305: 25.25,7.18 25.25,9.3 26.57,10.62 38.71,10.62 39.17,10.16 v39.17,8.84 38.23,7.9 38.23,5.92 39.19,4.95 52.55,4.95 52.89,5.29 52.89,5.79 | U1.IO5 52.89,5.79 | v53.19,5.69 52.99,5.69 52.89,5.79
  Bottom 0.305: R2.1 v39.17,8.84 | J2.7 53.19,4.46 v53.19,5.69
IO12/MISO  (via drill 0.3)  (1 unrouted)
  Top 0.305: v49.23,18.19 49.17,18.24 49.17,23.06 47.81,24.43 U1.IO12 47.81,26.22 48.92,27.33 50.34,27.33 53.27,30.26 J1.6
  Bottom 0.305: R18.1 49.91,18.19 v49.23,18.19
IO13/MOSI  (via drill 0.3)
  Top 0.305: 46.28,20.47 47.19,20.47 47.78,19.89 v47.78,16.74 | 46.28,20.47 45.62,20.47 44.98,21.11 44.98,24.76 U1.IO13 45.27,26.29 48.23,29.26 49.39,29.26 J1.7 | 46.28,20.47 U3.16
  Bottom 0.305: R17.1 v47.78,16.74
IO14/SCLK  (via drill 0.3)  (1 unrouted)
  Top 0.305: U3.13 49.05,25.06 49.05,26.21 49.43,26.59 50.75,26.59 v53.26,29.11 | U1.IO14 49.08,24.13 49.84,23.37 49.84,21.87 v50.6,21.11
  Bottom 0.305: J1.8 49.68,29.11 v53.26,29.11
  Bottom 0.406: R16.1 51.33,21.11 v50.6,21.11
IO15/NSS  (via drill 0.3)
  Top 0.305: U1.IO15 45.27,8.56 44.93,8.89 44.93,11.18 45.36,11.61 U3.23 47.57,11.6 48.46,12.5 48.46,14.71 v48.97,15.21 | J1.9 45.64,29.44 43.16,26.95 40.97,26.95 40.56,26.54 40.56,23.93 42.16,22.33 42.16,19.25 44.4,17.02 v44.4,16.79
  Bottom 0.305: R6.1 49,15.24 v48.97,15.21 47.75,15.21 46.18,16.79 v44.4,16.79
IO16  (via drill 0.3)  (1 unrouted)
  Top 0.254: 50.37,7.02 U1.NC1
  Top 0.305: 50.37,7.02 50.37,6.04 v50.67,5.74
  Bottom 0.305: J2.8 49.82,3.63 51.41,3.63 52.35,4.57 52.35,6.07 51.97,6.45 51.03,6.45 50.67,6.1 v50.67,5.74
IO17  (via drill 0.3)  (1 unrouted)
  Top 0.254: U1.NC2
  Top 0.305: U1.NC2 v51.62,5.77 v51.61,5.77
  Bottom 0.305: v51.61,5.77 51.61,5.03 50.88,4.29 48.46,4.29 46.17,2 J2.9
IO18  (via drill 0.3)
  Top 0.305: U1.IO18 U3.30 54.14,4.99 53.54,4.39 38.68,4.39 37.36,5.71 v37.36,9.04
  Bottom 0.305: v37.36,9.04 37.36,9.55 37.34,9.58 36.86,9.58 U4.6
IO19  (via drill 0.3)  (1 unrouted)
  Top 0.305: U1.IO19 U3.31 | 55.4,7.03 U3.31 | U3.31 55.41,4.82 54.43,3.83 38.28,3.83 36.52,5.59 36.52,8.56 v36.5,8.59
  Bottom 0.305: U4.7 36.52,8.56 v36.5,8.59
IO21  (1 unrouted)
  Top 0.305: 57.94,7.03 U3.33
IO22  (1 unrouted)
  Top 0.305: J2.10 44.39,3.28 54.99,3.28 56.44,4.72 60.38,4.72 61.76,6.11 U3.36
IO23  (1 unrouted)
  Top 0.305: U1.IO23 U3.37
IO25  (via drill 0.3)  (2 unrouted)
  Top 0.305: U3.10 52.87,26.38 53.85,27.36 v53.85,28.4
  Bottom 0.305: J1.10 45.31,28.4 53.67,28.4
IO26  (via drill 0.3)  (1 unrouted)
  Top 0.305: v53.06,27.66 51.6,26.2 U3.11
  Bottom 0.305: J1.11 43.51,27.66 v53.06,27.66
IO27  (via drill 0.3 pad 0.25)  (1 unrouted)
  Top 0.305: 50.32,25.03 U3.12 50.33,23.86 50.62,23.57 53.85,23.57 54.33,23.09 v54.33,21.7
  Bottom 0.305: v54.33,21.7 R21.1
IO32  (via drill 0.3)  (1 unrouted)
  Top 0.305: U1.IO32 U3.8 55.41,24.39 56.24,23.57 v57.28,23.57 | v42.72,16.54 40.79,18.47 40.79,21.51 39.83,22.48 v39.83,23.24
  Bottom 0.305: v39.83,23.24 40.08,23.24 40.87,24.03 56.82,24.03 v57.28,23.57 | R8.2 42.44,16.82 v42.72,16.54
IO33  (via drill 0.3)  (1 unrouted)
  Top 0.305: U3.9 54.13,25.03 54.13,24.41 55.73,22.81 v56.57,22.81 | v42.57,17.78 41.45,18.9 41.45,21.95 v40.66,22.73
  Bottom 0.305: v40.66,22.73 41.4,23.47 55.91,23.47 v56.57,22.81 | R13.2 42.01,18.34 v42.57,17.78
IO34  (1 unrouted)
IO35  (via drill 0.3)  (1 unrouted)
  Top 0.305: U3.7 56.68,27.04 v56.67,27.05
  Bottom 0.305: J1.12 41.68,26.95 56.57,26.95 v56.67,27.05
IO36/SVP  (via drill 0.3)  (1 unrouted)
  Top 0.305: U1.SENSOR_VP | U3.4 60.49,23.89 v59.13,22.53
  Bottom 0.305: J2.11 42.15,3.58 46.86,3.58 53.23,9.94 53.57,10.29 53.67,10.39 57.48,10.39 58.34,11.25 58.34,22 58.88,22.53 v59.13,22.53
IO39/SVN  (via drill 0.3)  (1 unrouted)
  Top 0.305: U3.5 59.22,24.02 v58.57,23.37
  Bottom 0.305: J2.12 38.4,2 40.62,4.22 46.61,4.22 53.39,11 56.92,11 57.71,11.79 57.71,22.5 v58.57,23.37
LEDRUN
  Bottom 0.61: U4.1 37.96,20.91 39.01,19.86 R22.1
LEDRX
  Bottom 0.61: U4.5 37.67,12.12 39.27,13.72 R20.1
LEDTX
  Bottom 0.61: U4.4 38.09,14.31 39.04,15.27 R15.1
N$1
  Bottom 0.61: R15.2 D1.A
N$2
  Bottom 0.254: IC1.16 13.44,14.23 C21.1
N$3  (via drill 0.3)  (1 unrouted)
  Top 0.406: OLED1.14 v22.47,4.63 v22.48,4.62
  Bottom 0.406: v22.48,4.62 22.68,4.42 37.92,4.42 39.57,6.07 44.46,6.07 D7.+ 45.62,8.65 45.49,8.79 | R1.1 45.49,8.79 | 45.49,8.79 46.2,8.79 C17.2 | 44.91,8.71 45.19,8.71 45.62,8.28 46.15,8.81 46.3,8.81
N$4  (via drill 0.3)
  Top 0.305: OLED1.15 23.17,10.34 24.08,11.25 39.5,11.25 v39.52,11.23
  Bottom 0.254: 40.26,12.04 R25.1
  Bottom 0.305: 40.26,10.92 40.26,11.23 | 40.26,11.23 40.26,11.53 | 40.26,11.53 40.26,12.04 | v39.52,11.23 39.95,11.23 | 39.95,11.23 40.26,11.23 | R5.1 40.26,10.92 | 40.26,10.92 39.95,11.23 | 39.95,11.23 40.26,11.53
N$5
  Bottom 0.813: R3.2 PWR.C
N$6  (via drill 0.3)
  Top 0.254: OLED1.27 31.57,2.49 v31.22,2.13
  Bottom 0.254: v31.22,2.13 C28.2
N$7  (via drill 0.3)
  Top 0.305: OLED1.3 14.77,5.04 14.1,4.37 11.07,4.37 v9.88,3.17
  Bottom 0.305: C26.2 v9.88,3.17
N$8  (via drill 0.3)
  Top 0.254: OLED1.28 32.27,3.95 v34.19,2.03
  Bottom 0.254: v34.19,2.03 C29.2
N$9  (via drill 0.3)
  Top 0.254: OLED1.26 30.87,3.34 v29.77,2.23
  Bottom 0.254: v29.77,2.23 R26.1
N$10
  Bottom 0.61: R13.1 39.01,18.34 38.63,18.72 38.63,18.71 U4.2
N$11
  Bottom 0.61: U4.3 39.93,16.52 R8.1
N$13
  Bottom 0.254: Q4.1 9.63,10.58 R12.1
N$14
  Bottom 0.305: Q3.1 9.81,7.38 R11.1
N$15  (via drill 0.3)
  Top 0.406: FLASH.2 1.42,6.22 v2.01,5.64
  Bottom 0.406: R10.1 1.61,6.04 v2.01,5.64
N$16
  Bottom 0.61: R20.2 43.26,13.72 D2.A
N$17
  Bottom 0.305: D4.A 54.33,17.65
  Bottom 0.406: 54.33,17.65 R21.2
N$18
  Bottom 0.406: R22.2 43.46,19.86 D5.A
N$19  (via drill 0.3)
  Top 0.305: OLED1.2 14.07,5.21 13.79,4.93 10.19,4.93 v9.91,4.65
  Bottom 0.305: C26.1 9.96,4.7 v9.91,4.65
N$21  (via drill 0.3)
  Top 0.305: OLED1.4 15.47,4.83 14.45,3.81 13.44,3.81 v13.28,3.66
  Bottom 0.305: C27.1 12.85,4.7 13.28,4.27 v13.28,3.66
N$22  (via drill 0.3)
  Top 0.305: OLED1.5 16.17,4.66 14.58,3.07 v14.02,3.07
  Bottom 0.305: C27.2 12.55,2.9 13.84,2.9 v14.02,3.07
N$23
  Bottom 0.406: U6.2 1.63,25.12 R27.1
N$25  (via drill 0.3)
  Top 0.254: 3.91,18.13 v3.61,17.83 4.22,18.44 4.88,18.44 5.18,18.13 USB-TTL.A5
  Bottom 0.254: v3.61,17.83 R31.2
N$26  (via drill 0.3)
  Top 0.254: USB-TTL.B5 5.26,15.13 4.85,15.54 4.32,15.54 v3.58,16.28
  Bottom 0.254: v3.58,16.28 R30.2
N$27  (via drill 0.3)
  Top 0.406: v17.65,2.72 20.17,2.72 J3.3
  Bottom 0.406: U4.11 17.59,9.91 18.03,9.47 18.03,3.1 v17.65,2.72
N$28
  Bottom 0.406: U4.12 17.48,12.12 19,10.59 J3.2
N$29  (via drill 0.3)
  Top 0.406: v8.03,25.12 7.37,24.46 R28.2
  Bottom 0.406: U6.7 v8.03,25.12
N$30  (via drill 0.3)
  Top 0.406: v8,26.9 R29.2
  Bottom 0.406: U6.6 8.51,26.39 v8,26.9
N$31
  Top 0.406: D8.C R28.1
N$32
  Top 0.406: D9.C R29.1
N$76
  Bottom 0.61: U5.4 C30.1
NC  (1 unrouted)
RESET  (via drill 0.3)  (1 unrouted)
  Top 0.305: J1.3 61.78,29.71 U1.EN 61.78,24.08 59.28,21.59 v59.11,21.59 | v21.18,3.45 16.64,3.45 14.91,1.73 7.95,1.73 7.21,2.46 v7.21,9.63 | v51.21,10.01 v59.11,10.01
  Top 0.406: RST.2 1.22,9.78 v1.85,10.41
  Bottom 0.305: v21.18,3.45 21.36,3.28 38.66,3.28 40.21,4.83 46.25,4.83 51.21,9.78 v51.21,10.01 | v59.11,21.59 v59.11,10.01
  Bottom 0.406: v1.85,10.41 1.65,10.21 C5.1 3.13,9.5 R9.1 5.96,9.46 Q4.3 v7.21,9.63
RTS  (via drill 0.3)
  Top 0.254: v9.68,9.49 9.68,10.8 IC1.19 12,12.48 v12.01,12.47
  Bottom 0.254: IC1.19 12,12.48 v12.01,12.47 | Q4.2 9.53,8.68 | 9.53,8.68 10.03,8.68 R11.2 | v9.68,9.49 9.68,8.83 9.53,8.68
RXD  (via drill 0.3)  (1 unrouted)
  Top 0.305: U3.34 59.26,7.08 59.26,8.31 59.51,8.56 60.6,8.56 v60.63,8.53 | v39.84,25.02 39.6,25.02 38.18,23.6 38.18,20.93 37.19,19.94 20.98,19.94 v12.47,11.43
  Bottom 0.254: IC1.21 10.36,11.36 11.07,10.64 12.29,10.64 12.47,10.82 v12.47,11.43
  Bottom 0.305: v39.84,25.02 39.99,25.17 58.98,25.17 60.63,23.52 v60.63,8.53 60.63,2.26 J2.3
SD0
  Top 0.305: U1.SD0 42.73,7.8 43.64,8.71 43.64,12.06 45.54,13.97 46.13,13.97 U3.21
SD1
  Top 0.305: U1.SD1 44.3,7.34 44.3,11.4 45.76,12.87 U3.22
SD2
  Top 0.305: U1.SD2 44,24.63 44.27,24.36 44.27,20.7 45.62,19.36 46.17,19.36 U3.17
SD3
  Top 0.305: U1.SD3 42.73,23.87 43.54,23.06 43.54,20.17 45.64,18.06 46.19,18.06 U3.18
TXD  (via drill 0.3)  (1 unrouted)
  Top 0.305: 60.5,7.06 U3.35 | U1.TXD0 60.51,6 59.96,5.45 v59.72,5.45 | v39.83,24.16 39.7,24.16 38.79,23.24 38.79,20.55 37.57,19.33 21.44,19.33 12.8,10.69 11.94,10.69 11.58,11.05 v11.58,11.4
  Bottom 0.254: IC1.20 10.86,11.64 11.1,11.4 v11.58,11.4
  Bottom 0.305: v39.83,24.16 40.13,24.16 40.56,24.59 58.57,24.59 59.87,23.29 59.87,5.3 | J2.4 59.87,3.52 59.87,5.3 | 59.87,5.3 v59.72,5.45
VBAT
  Top 0.813: Q1.3 11.15,31.22 | C4.1 11.28,31.1 11.15,31.22 | 11.15,31.22 9.97,31.22 J6.1
  Bottom 0.254: U6.5 8.97,30.08 | D11.+ 9.06,31.68
  pour Bottom: 8.28,27.3 8.28,29.26 7.44,30.1 7.44,31.6 7.98,32.13 11.86,32.13 11.86,30.86 10.41,30.86 9.73,30.18 9.73,27.36 9.73,27.3
VBUS  (via drill 0.3)  (4 unrouted)
  Top 0.254: USB-TTL.VBUS2 5.71,14.61 | v3.61,14.76 4.95,14.76 5.11,14.61 6.12,14.61
  Top 0.305: USB-TTL.VBUS1 5.39,19.33 5.08,19.02 3.91,19.02 v3.61,19.33
  Top 0.61: Q1.1 12.71,30.18 v12.7,30.2 | USB-TTL.VBUS1 7.42,19.33 | 7.42,19.33 9.39,19.33 v9.91,18.82 | 7.42,19.33 7.42,15.04 6.82,14.43 USB-TTL.VBUS2 | 6.78,19.33 7.42,18.69 9.93,18.69 10.01,18.77 10.01,18.85 8.89,19.96 7.95,19.02 | 7.95,19.02 7.82,19.02 | 7.95,19.02 8.36,19.02 | 9.32,19.02 8.36,19.02 | 8.36,19.02 7.42,18.09
  Top 0.813: v1.87,27.91 v1.88,27.91 1.13,27.17 D9.A D8.A 1.14,24.45 1.14,23.47 1.5,23.11 7.64,23.11 | Q1.1 12.71,28.23 8.97,24.49 | 8.97,24.49 v8.97,23.22 | v8.97,23.22 8.97,21.95 | 8.97,21.95 8.97,19.76 v9.91,18.82 | 7.64,23.11 7.8,23.11 | 7.8,23.11 8.87,23.11 v8.97,23.22 | 7.64,23.11 7.64,23.16 7.8,23.32 | 8.97,24.49 7.8,23.32 | 7.8,23.32 7.8,23.11 | 7.8,23.11 8.97,21.95
  Bottom 0.254: IC1.8 9.36,17.44 | v3.61,14.76 2.82,14.76 C1.1
  Bottom 0.305: C18.1 1.63,27.66 v1.88,27.91
  Bottom 0.406: 9.36,17.44 C19.1 | U6.4 C18.1 | C2.1 v3.61,19.33 | v8.97,23.22 U6.8 8.97,23.09 R24.1 | 8.13,22.25 8.84,22.25 9.4,22.81 9.4,23.9 8.53,23.9 8.53,23.16 8.13,22.76 8.46,22.76 8.66,22.55 8.69,22.55 9.09,22.96 9.09,23.55 8.76,23.55 8.76,22.78 8.59,22.61
  Bottom 0.61: D10.+ 13.74,31.24 v12.7,30.2 | C18.1 1.37,27.66 | 2.34,27.71 3.1,27.71 2.64,28.17 0.91,28.17 0.91,27.53
  Bottom 0.813: C19.1 v9.91,18.82
VDD  (via drill 0.3)
  Top 0.254: v14.63,29.95 14.63,29.14 Q1.2
  Top 0.813: v39.37,26.04 37.29,23.95 37.29,21.41 36.63,20.75 13.16,20.75 v10.74,23.16
  Bottom 0.254: 13.96,29.28 D10.- D11.- 11.46,28.04 C13.2 C7.1 10.49,25.58 10.49,25.04 | 10.49,25.04 10.49,23.55 10.96,23.08 U5.1 | U5.3 11.84,25.04 10.49,25.04
  Bottom 0.813: v39.37,26.04 59.61,26.04 61.65,24 61.65,6.32 J2.1
  pour Bottom: 12.55,22.66 10.64,22.66 10.24,23.06 10.24,29.16 10.77,29.69 13.77,29.69 14.38,30.3 14.96,30.3 14.96,29.13 14.5,28.68 12.29,28.68 11.99,28.37 11.99,25.81 12.52,25.27 12.52,24.71 11.23,24.71 10.97,24.46 10.9,24.38 10.9,23.6 11.1,23.39 12.52,23.39 12.55,23.39

### Text on the board
tPlace: - | + | 3V3 | GND
bPlace: - | + | IO35 | IO26 | IO25 | IO15 | IO14 | IO13 | IO12 | IO2 | GND | RST | GND | 3V3 | ESP32 AT | UWB Pro with | Display v1.1 | www.makerfabs.com | IO36 | IO22 | GND | IO39 | IO17 | IO16 | IO5 | IO4 | IO0 | TXD | RXD | VDD | 3V3 | CLK | DIO | GND
tNames: U1